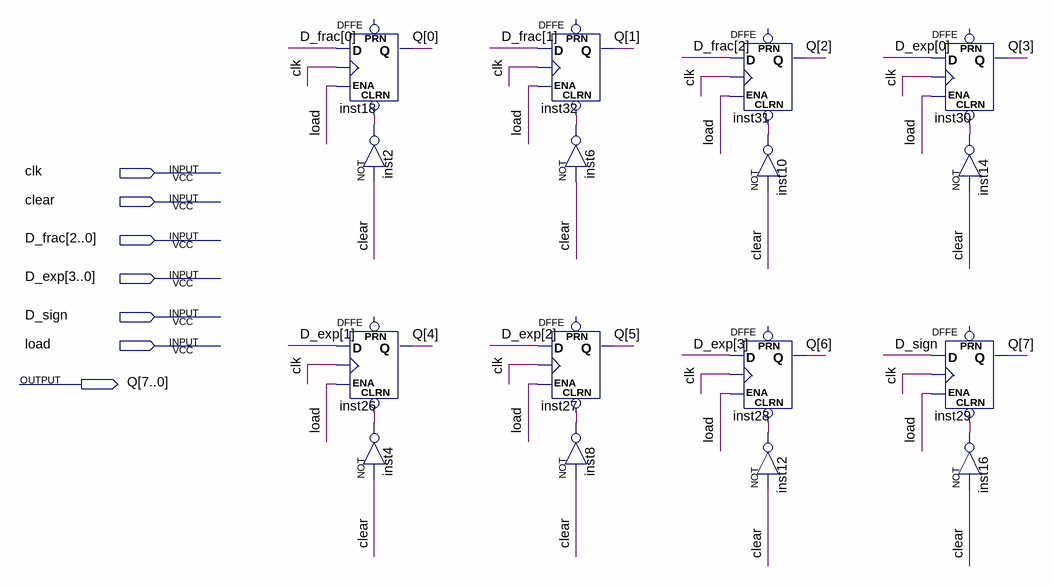
[diagram p0: schematic sheet]
// Quartus schematic R_out.bdf as structural Verilog: 16 symbols, 7 pins
module R_out (
  input  clk,
  input  clear,
  input  [2:0] D_frac,
  input  [3:0] D_exp,
  input  D_sign,
  input  load,
  output [7:0] Q
);

  wire inst2_out, inst4_out, inst6_out, inst8_out, inst10_out, inst12_out, inst14_out, inst16_out;

  DFFE inst18 (.CLRN(inst2_out), .D(D_frac[0]), .CLK(clk), .ENA(load), .Q(Q[0]));  // open: PRN
  not inst2 (inst2_out, clear);
  DFFE inst26 (.CLRN(inst4_out), .D(D_exp[1]), .CLK(clk), .ENA(load), .Q(Q[4]));  // open: PRN
  not inst4 (inst4_out, clear);
  DFFE inst32 (.CLRN(inst6_out), .D(D_frac[1]), .CLK(clk), .ENA(load), .Q(Q[1]));  // open: PRN
  not inst6 (inst6_out, clear);
  DFFE inst27 (.CLRN(inst8_out), .D(D_exp[2]), .CLK(clk), .ENA(load), .Q(Q[5]));  // open: PRN
  not inst8 (inst8_out, clear);
  DFFE inst31 (.CLRN(inst10_out), .D(D_frac[2]), .CLK(clk), .ENA(load), .Q(Q[2]));  // open: PRN
  not inst10 (inst10_out, clear);
  DFFE inst28 (.CLRN(inst12_out), .D(D_exp[3]), .CLK(clk), .ENA(load), .Q(Q[6]));  // open: PRN
  not inst12 (inst12_out, clear);
  DFFE inst30 (.CLRN(inst14_out), .D(D_exp[0]), .CLK(clk), .ENA(load), .Q(Q[3]));  // open: PRN
  not inst14 (inst14_out, clear);
  DFFE inst29 (.CLRN(inst16_out), .D(D_sign), .CLK(clk), .ENA(load), .Q(Q[7]));  // open: PRN
  not inst16 (inst16_out, clear);
endmodule
